# EAGLE schematic AuxTalon_LoadSwitch (EAGLE 9.6.2)

## Sheet 1 of 3

## Sheet 2 of 3
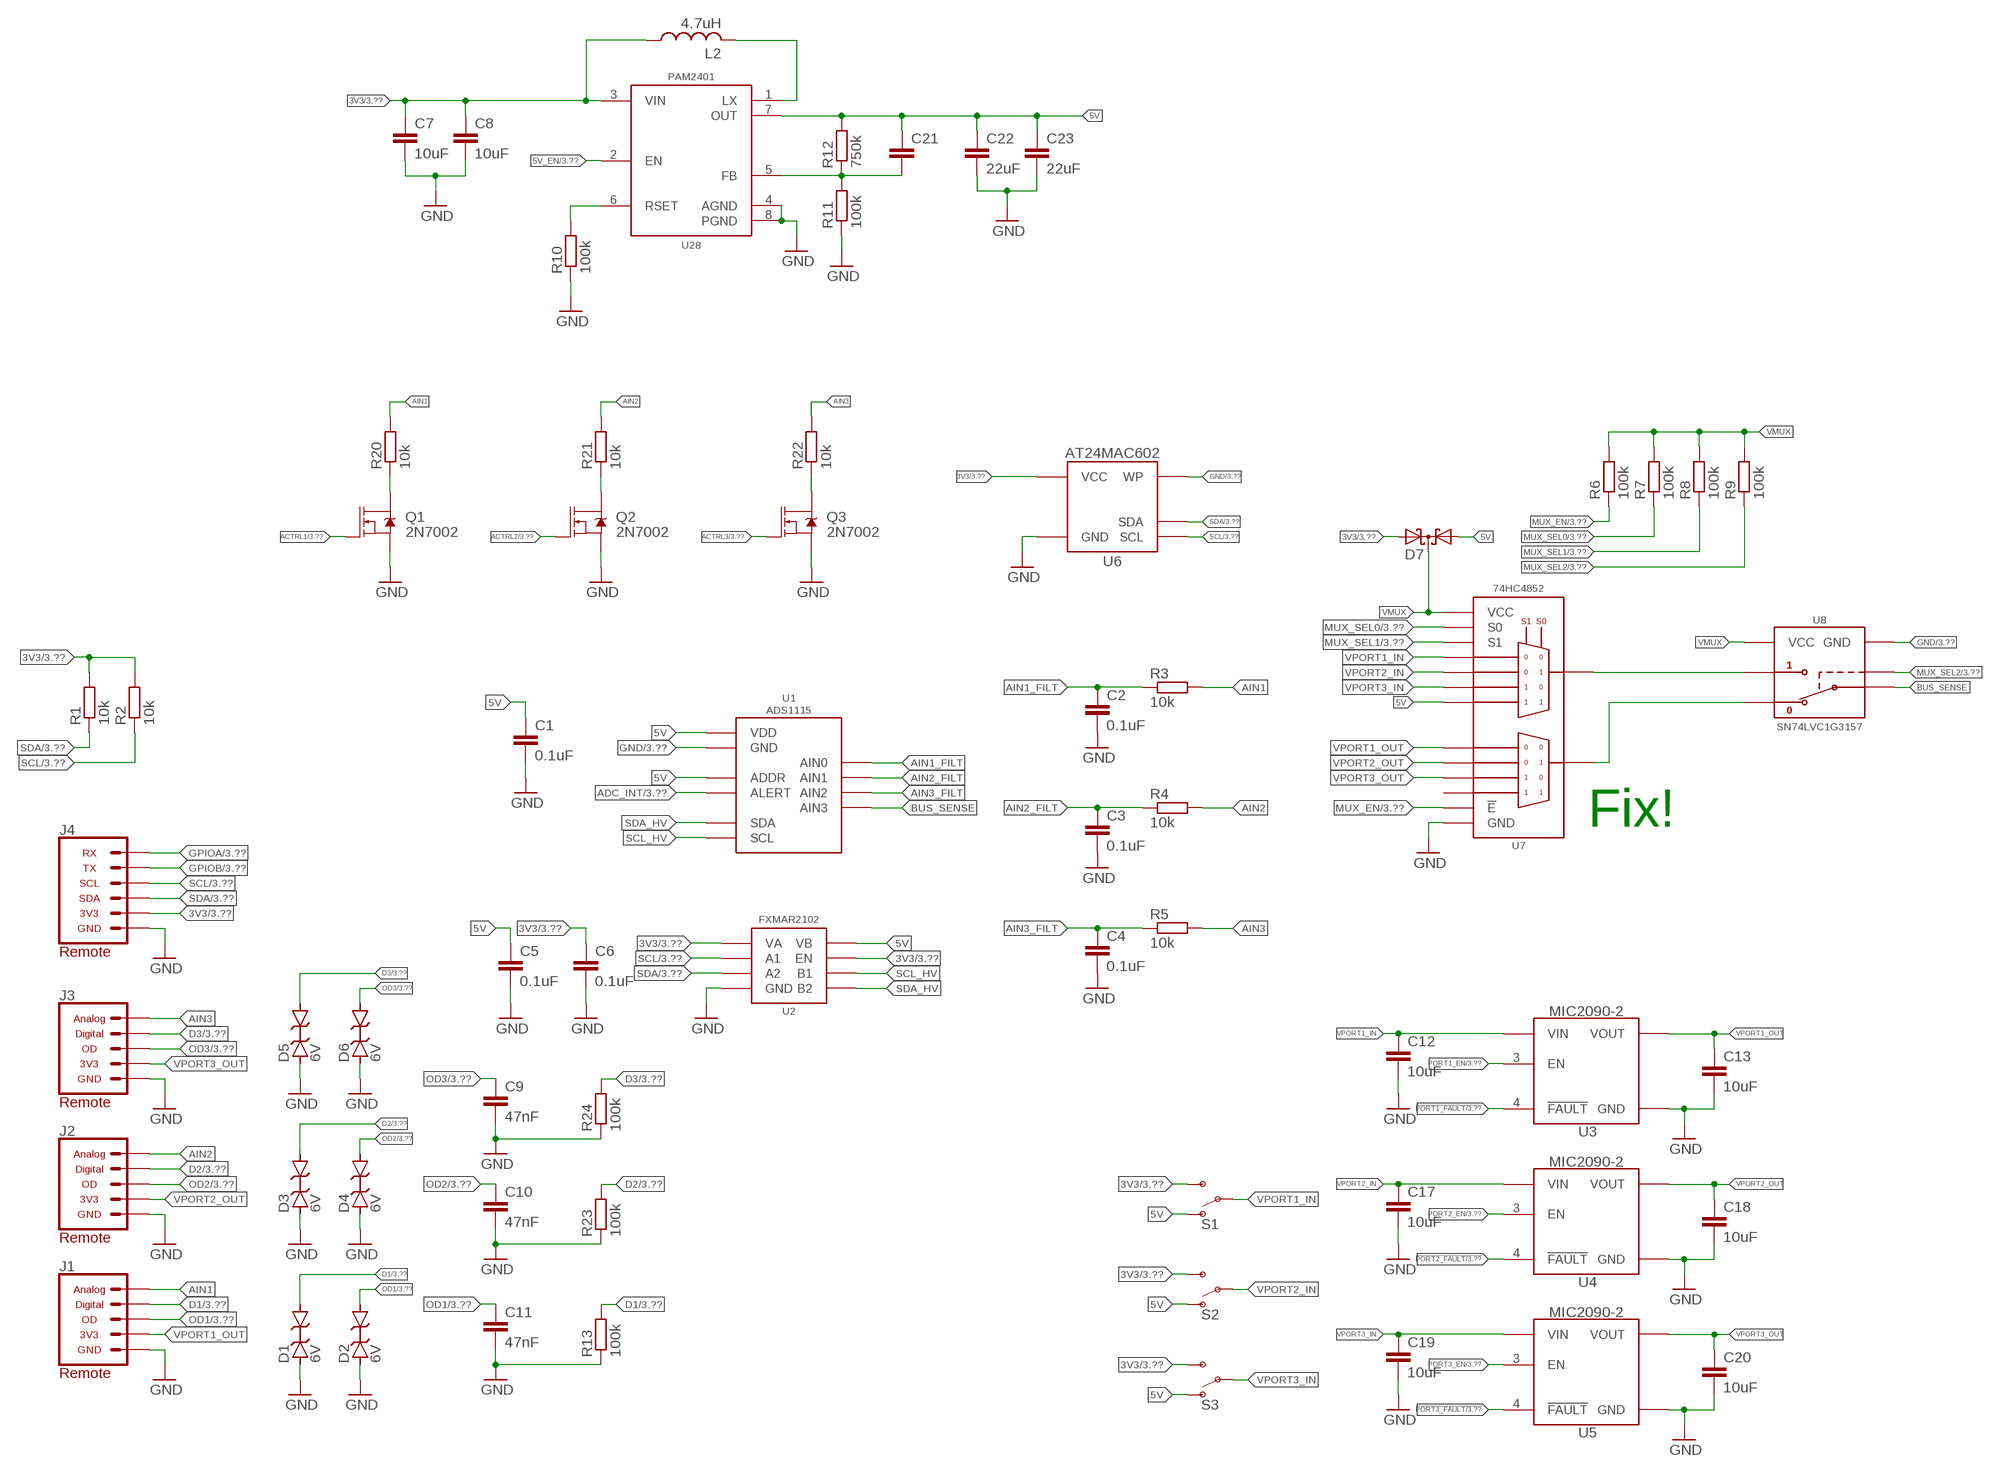
[diagram p0: schematic, sheet 2]

### Parts
C1  0.1uF  C-EU0.1UFC0402  [C0402]
C2  0.1uF  C-EU0.1UFC0805  [C0805]
C3  0.1uF  C-EU0.1UFC0805  [C0805]
C4  0.1uF  C-EU0.1UFC0805  [C0805]
C5  0.1uF  C-EU0.1UFC0402  [C0402]
C6  0.1uF  C-EU0.1UFC0402  [C0402]
C7  10uF  C-EU10UFC0805  [C0805]
C8  10uF  C-EU10UFC0805  [C0805]
C9  47nF  C-EU47NFC0402  [C0402]
C10  47nF  C-EU47NFC0402  [C0402]
C11  47nF  C-EU47NFC0402  [C0402]
C12  10uF  C-EU10UFC0805  [C0805]
C13  10uF  C-EU10UFC0603  [C0603]
C17  10uF  C-EU10UFC0805  [C0805]
C18  10uF  C-EU10UFC0603  [C0603]
C19  10uF  C-EU10UFC0805  [C0805]
C20  10uF  C-EU10UFC0603  [C0603]
C21  C-EUC0402  [C0402]
C22  22uF  C-EU22UFC0805  [C0805]
C23  22uF  C-EU22UFC0805  [C0805]
D1  6V  DIODE_ESD_BI_D5V0L1_0402  [D0402]
D2  6V  DIODE_ESD_BI_D5V0L1_0402  [D0402]
D3  6V  DIODE_ESD_BI_D5V0L1_0402  [D0402]
D4  6V  DIODE_ESD_BI_D5V0L1_0402  [D0402]
D5  6V  DIODE_ESD_BI_D5V0L1_0402  [D0402]
D6  6V  DIODE_ESD_BI_D5V0L1_0402  [D0402]
D7  DIODE_CCBAT54CSOT23  [SOT23-3]
J1  CONN_AUX_M12_REMOTE  [1X05_M12_TE_T41410]
J2  CONN_AUX_M12_REMOTE  [1X05_M12_TE_T41410]
J3  CONN_AUX_M12_REMOTE  [1X05_M12_TE_T41410]
J4  CONN_TALON_REMOTE  [1X06_MICROLOCKPLUS]
L2  4.7uH  INDUCTOR_MAPI_2.5X2  [WE-MAPI(2.5X2)]
Q1  2N7002  MOSFET-NCH-2N7002P  [SOT23-3]
Q2  2N7002  MOSFET-NCH-2N7002P  [SOT23-3]
Q3  2N7002  MOSFET-NCH-2N7002P  [SOT23-3]
R1  10k  R-EU_10KR0402  [R0402]
R2  10k  R-EU_10KR0402  [R0402]
R3  10k  R-EU_10KR0402  [R0402]
R4  10k  R-EU_10KR0402  [R0402]
R5  10k  R-EU_10KR0402  [R0402]
R6  100k  R-EU_100KR0402  [R0402]
R7  100k  R-EU_100KR0402  [R0402]
R8  100k  R-EU_100KR0402  [R0402]
R9  100k  R-EU_100KR0402  [R0402]
R10  100k  R-EU_100KR0603  [R0603]
R11  100k  R-EU_100KR0603  [R0603]
R12  750k  R-EU_750KR0603  [R0603]
R13  100k  R-EU_100KR0402  [R0402]
R20  10k  R-EU_10KR0402  [R0402]
R21  10k  R-EU_10KR0402  [R0402]
R22  10k  R-EU_10KR0402  [R0402]
R23  100k  R-EU_100KR0402  [R0402]
R24  100k  R-EU_100KR0402  [R0402]
S1  SPDTCAS-120A1  [CAS-120A1]
S2  SPDTCAS-120A1  [CAS-120A1]
S3  SPDTCAS-120A1  [CAS-120A1]
U1  ADS1115  [VSSOP_10]
U2  FXMAR2102UMLP  [UQFN-8_1.4X1.2]
U3  MIC2090-2  [SOT23-5]
U4  MIC2090-2  [SOT23-5]
U5  MIC2090-2  [SOT23-5]
U6  AT24MAC602SOT23  [SOT23-5]
U7  74HC4852  [VQFN-16]
U8  SN74LVC1G3157SC70  [DCK_R-PDSO-G6]
U28  PAM2401MSOP  [MSOP_8]

### Nets
3V3: C6.1 C7.1 C8.1 D7.2(A2) J4.2(3V3) L2.P$1 R1.2 R2.2 S1.3(S) S2.3(S) S3.3(S) U2.1(VA) U2.5(EN) U6.4(VCC) U28.3(VIN) ; also sheet 3
5V: C1.1 C5.1 C21.1 C22.1 C23.1 D7.1(A1) R12.2 S1.1(O) S2.1(O) S3.1(O) U1.1(ADDR) U1.8(VDD) U2.8(VB) U7.11(1Y3) U28.7(OUT)
5V_EN: U28.2(EN) ; also sheet 3
!PORT1_FAULT: U3.4(!FAULT) ; also sheet 3
!PORT2_FAULT: U4.4(!FAULT) ; also sheet 3
!PORT3_FAULT: U5.4(!FAULT) ; also sheet 3
ACTRL1: Q1.1(G) ; also sheet 3
ACTRL2: Q2.1(G) ; also sheet 3
ACTRL3: Q3.1(G) ; also sheet 3
ADC_INT: U1.2(ALERT) ; also sheet 3
AIN1: J1.4(ANALOG) R3.2 R20.2
AIN1_FILT: C2.1 R3.1 U1.4(AIN0)
AIN2: J2.4(ANALOG) R4.2 R21.2
AIN2_FILT: C3.1 R4.1 U1.5(AIN1)
AIN3: J3.4(ANALOG) R5.2 R22.2
AIN3_FILT: C4.1 R5.1 U1.6(AIN2)
BUS_SENSE: U1.7(AIN3) U8.4(A)
D1: D1.2(C) J1.5(DIGITAL) R13.2 ; also sheet 3
D2: D3.2(C) J2.5(DIGITAL) R23.2 ; also sheet 3
D3: D5.2(C) J3.5(DIGITAL) R24.2 ; also sheet 3
GND: C1.2 C2.2 C3.2 C4.2 C5.2 C6.2 C7.2 C8.2 C9.2 C10.2 C11.2 C12.2 C13.2 C17.2 C18.2 C19.2 C20.2 C22.2 C23.2 D1.1(A) D2.1(A) D3.1(A) D4.1(A) D5.1(A) D6.1(A) J1.3(GND) J2.3(GND) J3.3(GND) J4.1(GND) Q1.2(S) Q2.2(S) Q3.2(S) R10.1 R11.1 R13.1 R23.1 R24.1 U1.3(GND) U2.4(GND) U3.2(GND) U4.2(GND) U5.2(GND) U6.2(GND) U6.5(WP) U7.8(GND) U7.EP(GND) U8.2(GND) U28.4(AGND) U28.8(PGND) ; also sheet 3
GPIOA: J4.6(RX) ; also sheet 3
GPIOB: J4.5(TX) ; also sheet 3
MUX_EN: R6.1 U7.6(!E) ; also sheet 3
MUX_SEL0: R7.1 U7.10(S0) ; also sheet 3
MUX_SEL1: R8.1 U7.9(S1) ; also sheet 3
MUX_SEL2: R9.1 U8.6(S) ; also sheet 3
N$1: U7.3(2Z) U8.3(B1)
N$2: R10.2 U28.6(RSET)
N$3: C21.2 R11.2 R12.1 U28.5(FB)
N$7: Q3.3(D) R22.1
N$14: Q2.3(D) R21.1
N$15: Q1.3(D) R20.1
N$18: L2.P$2 U28.1(LX)
N$38: U7.13(1Z) U8.1(B2)
OD1: C11.1 D2.2(C) J1.2(DIGITAL_OPENDRAIN) ; also sheet 3
OD2: C10.1 D4.2(C) J2.2(DIGITAL_OPENDRAIN) ; also sheet 3
OD3: C9.1 D6.2(C) J3.2(DIGITAL_OPENDRAIN) ; also sheet 3
PORT1_EN: U3.3(EN) ; also sheet 3
PORT2_EN: U4.3(EN) ; also sheet 3
PORT3_EN: U5.3(EN) ; also sheet 3
SCL: J4.4(SCL) R2.1 U2.2(A1) U6.1(SCL) ; also sheet 3
SCL_HV: U1.10(SCL) U2.7(B1)
SDA: J4.3(SDA) R1.1 U2.3(A2) U6.3(SDA) ; also sheet 3
SDA_HV: U1.9(SDA) U2.6(B2)
VMUX: D7.3(C) R6.2 R7.2 R8.2 R9.2 U7.16(VCC) U8.5(VCC)
VPORT1_IN: C12.1 S1.2(P) U3.1(VIN) U7.12(1Y0)
VPORT1_OUT: C13.1 J1.1(3V3) U3.5(VOUT) U7.1(2Y0)
VPORT2_IN: C17.1 S2.2(P) U4.1(VIN) U7.14(1Y1)
VPORT2_OUT: C18.1 J2.1(3V3) U4.5(VOUT) U7.5(2Y1)
VPORT3_IN: C19.1 S3.2(P) U5.1(VIN) U7.15(1Y2)
VPORT3_OUT: C20.1 J3.1(3V3) U5.5(VOUT) U7.2(2Y2)
Unconnected: U7.4(2Y3)

### Notes on the sheet
- Fix!

## Sheet 3 of 3
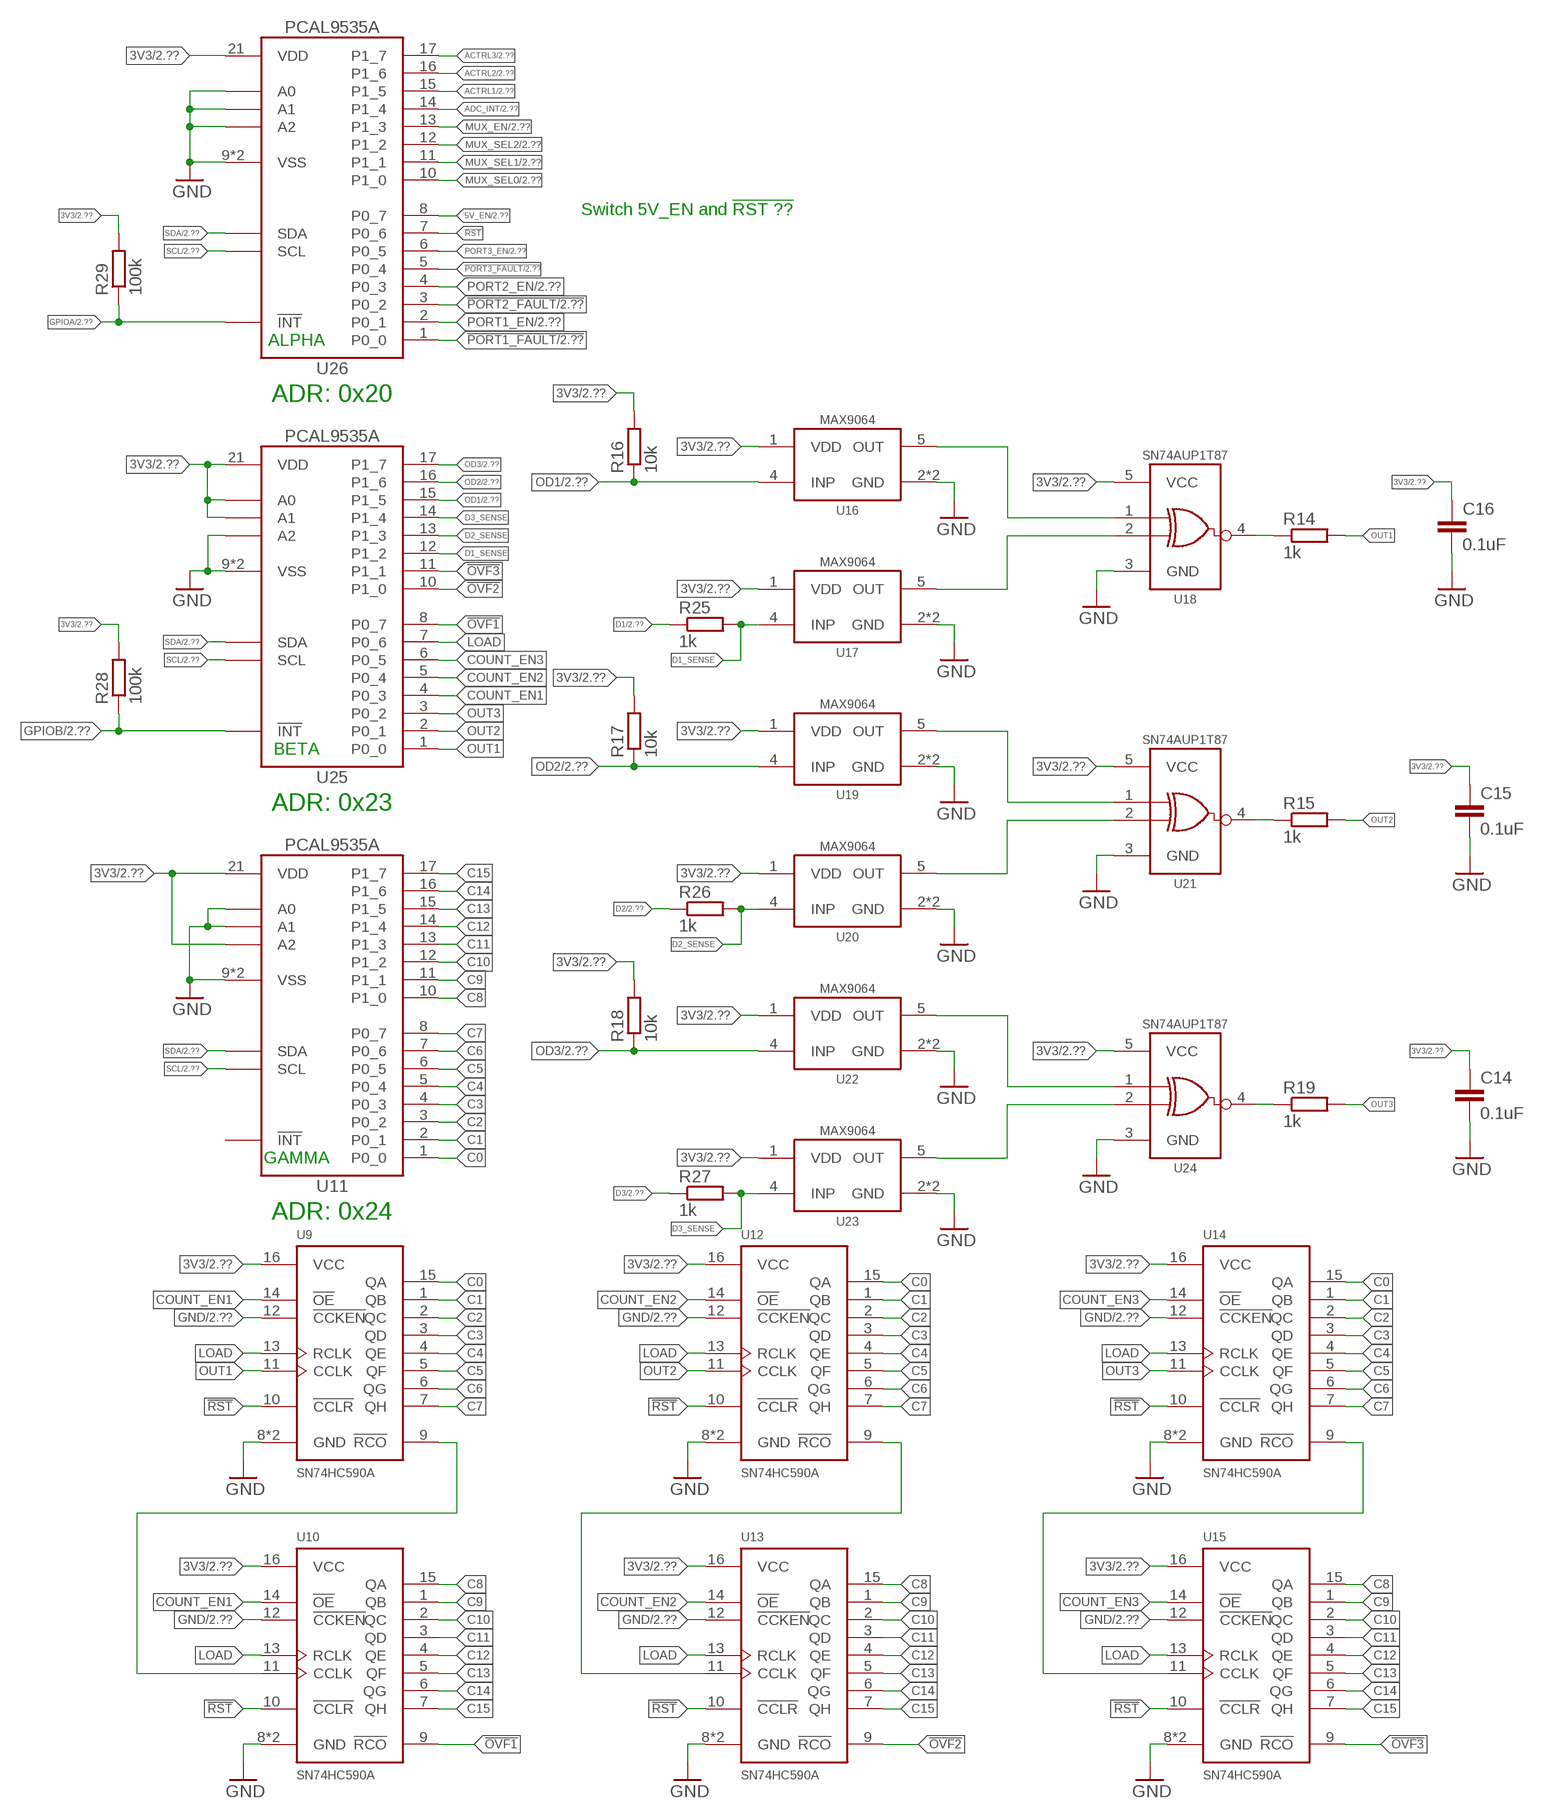
[diagram p1: schematic, sheet 3]

### Parts
C14  0.1uF  C-EU0.1UFC0402  [C0402]
C15  0.1uF  C-EU0.1UFC0402  [C0402]
C16  0.1uF  C-EU0.1UFC0402  [C0402]
R14  1k  R-EU_1KR0402  [R0402]
R15  1k  R-EU_1KR0402  [R0402]
R16  10k  R-EU_10KR0402  [R0402]
R17  10k  R-EU_10KR0402  [R0402]
R18  10k  R-EU_10KR0402  [R0402]
R19  1k  R-EU_1KR0402  [R0402]
R25  1k  R-EU_1KR0402  [R0402]
R26  1k  R-EU_1KR0402  [R0402]
R27  1k  R-EU_1KR0402  [R0402]
R28  100k  R-EU_100KR0402  [R0402]
R29  100k  R-EU_100KR0402  [R0402]
U9  SN74HC590AVQFN  [VQFN-16]
U10  SN74HC590AVQFN  [VQFN-16]
U11  PCAL9535AQFN  [QFN24]
U12  SN74HC590AVQFN  [VQFN-16]
U13  SN74HC590AVQFN  [VQFN-16]
U14  SN74HC590AVQFN  [VQFN-16]
U15  SN74HC590AVQFN  [VQFN-16]
U16  MAX9064  [SOT23-5]
U17  MAX9064  [SOT23-5]
U18  SN74AUP1T87  [DCK_R-PDSO-G5]
U19  MAX9064  [SOT23-5]
U20  MAX9064  [SOT23-5]
U21  SN74AUP1T87  [DCK_R-PDSO-G5]
U22  MAX9064  [SOT23-5]
U23  MAX9064  [SOT23-5]
U24  SN74AUP1T87  [DCK_R-PDSO-G5]
U25  PCAL9535AQFN  [QFN24]
U26  PCAL9535AQFN  [QFN24]

### Nets
3V3: C14.1 C15.1 C16.1 R16.2 R17.2 R18.2 R28.2 R29.2 U9.16(VCC) U10.16(VCC) U11.21(VDD) U11.24(A2) U12.16(VCC) U13.16(VCC) U14.16(VCC) U15.16(VCC) U16.1(VDD) U17.1(VDD) U18.5(VCC) U19.1(VDD) U20.1(VDD) U21.5(VCC) U22.1(VDD) U23.1(VDD) U24.5(VCC) U25.18(A0) U25.21(VDD) U25.23(A1) U26.21(VDD) ; also sheet 2
5V_EN: U26.8(P0_7) ; also sheet 2
!OVF1: U10.9(!RCO) U25.8(P0_7)
!OVF2: U13.9(!RCO) U25.10(P1_0)
!OVF3: U15.9(!RCO) U25.11(P1_1)
!PORT1_FAULT: U26.1(P0_0) ; also sheet 2
!PORT2_FAULT: U26.3(P0_2) ; also sheet 2
!PORT3_FAULT: U26.5(P0_4) ; also sheet 2
!RST: U9.10(!CCLR) U10.10(!CCLR) U12.10(!CCLR) U13.10(!CCLR) U14.10(!CCLR) U15.10(!CCLR) U26.7(P0_6)
ACTRL1: U26.15(P1_5) ; also sheet 2
ACTRL2: U26.16(P1_6) ; also sheet 2
ACTRL3: U26.17(P1_7) ; also sheet 2
ADC_INT: U26.14(P1_4) ; also sheet 2
C0: U9.15(QA) U11.1(P0_0) U12.15(QA) U14.15(QA)
C1: U9.1(QB) U11.2(P0_1) U12.1(QB) U14.1(QB)
C2: U9.2(QC) U11.3(P0_2) U12.2(QC) U14.2(QC)
C3: U9.3(QD) U11.4(P0_3) U12.3(QD) U14.3(QD)
C4: U9.4(QE) U11.5(P0_4) U12.4(QE) U14.4(QE)
C5: U9.5(QF) U11.6(P0_5) U12.5(QF) U14.5(QF)
C6: U9.6(QG) U11.7(P0_6) U12.6(QG) U14.6(QG)
C7: U9.7(QH) U11.8(P0_7) U12.7(QH) U14.7(QH)
C8: U10.15(QA) U11.10(P1_0) U13.15(QA) U15.15(QA)
C9: U10.1(QB) U11.11(P1_1) U13.1(QB) U15.1(QB)
C10: U10.2(QC) U11.12(P1_2) U13.2(QC) U15.2(QC)
C11: U10.3(QD) U11.13(P1_3) U13.3(QD) U15.3(QD)
C12: U10.4(QE) U11.14(P1_4) U13.4(QE) U15.4(QE)
C13: U10.5(QF) U11.15(P1_5) U13.5(QF) U15.5(QF)
C14: U10.6(QG) U11.16(P1_6) U13.6(QG) U15.6(QG)
C15: U10.7(QH) U11.17(P1_7) U13.7(QH) U15.7(QH)
COUNT_EN1: U9.14(!OE) U10.14(!OE) U25.4(P0_3)
COUNT_EN2: U12.14(!OE) U13.14(!OE) U25.5(P0_4)
COUNT_EN3: U14.14(!OE) U15.14(!OE) U25.6(P0_5)
D1: R25.1 ; also sheet 2
D1_SENSE: R25.2 U17.4(INP) U25.12(P1_2)
D2: R26.1 ; also sheet 2
D2_SENSE: R26.2 U20.4(INP) U25.13(P1_3)
D3: R27.1 ; also sheet 2
D3_SENSE: R27.2 U23.4(INP) U25.14(P1_4)
GND: C14.2 C15.2 C16.2 U9.8(GND) U9.12(!CCKEN) U9.EP(GND) U10.8(GND) U10.12(!CCKEN) U10.EP(GND) U11.9(VSS) U11.18(A0) U11.23(A1) U11.EP(VSS) U12.8(GND) U12.12(!CCKEN) U12.EP(GND) U13.8(GND) U13.12(!CCKEN) U13.EP(GND) U14.8(GND) U14.12(!CCKEN) U14.EP(GND) U15.8(GND) U15.12(!CCKEN) U15.EP(GND) U16.2(GND) U16.3(GND) U17.2(GND) U17.3(GND) U18.3(GND) U19.2(GND) U19.3(GND) U20.2(GND) U20.3(GND) U21.3(GND) U22.2(GND) U22.3(GND) U23.2(GND) U23.3(GND) U24.3(GND) U25.9(VSS) U25.24(A2) U25.EP(VSS) U26.9(VSS) U26.18(A0) U26.23(A1) U26.24(A2) U26.EP(VSS) ; also sheet 2
GPIOA: R29.1 U26.22(!INT) ; also sheet 2
GPIOB: R28.1 U25.22(!INT) ; also sheet 2
LOAD: U9.13(RCLK) U10.13(RCLK) U12.13(RCLK) U13.13(RCLK) U14.13(RCLK) U15.13(RCLK) U25.7(P0_6)
MUX_EN: U26.13(P1_3) ; also sheet 2
MUX_SEL0: U26.10(P1_0) ; also sheet 2
MUX_SEL1: U26.11(P1_1) ; also sheet 2
MUX_SEL2: U26.12(P1_2) ; also sheet 2
N$4: U9.9(!RCO) U10.11(CCLK)
N$5: U12.9(!RCO) U13.11(CCLK)
N$6: U14.9(!RCO) U15.11(CCLK)
N$8: U20.5(OUT) U21.2(B)
N$9: U19.5(OUT) U21.1(A)
N$10: U16.5(OUT) U18.1(A)
N$11: U17.5(OUT) U18.2(B)
N$12: U23.5(OUT) U24.2(B)
N$13: U22.5(OUT) U24.1(A)
N$16: R14.1 U18.4(Y)
N$17: R15.1 U21.4(Y)
N$19: R19.1 U24.4(Y)
OD1: R16.1 U16.4(INP) U25.15(P1_5) ; also sheet 2
OD2: R17.1 U19.4(INP) U25.16(P1_6) ; also sheet 2
OD3: R18.1 U22.4(INP) U25.17(P1_7) ; also sheet 2
OUT1: R14.2 U9.11(CCLK) U25.1(P0_0)
OUT2: R15.2 U12.11(CCLK) U25.2(P0_1)
OUT3: R19.2 U14.11(CCLK) U25.3(P0_2)
PORT1_EN: U26.2(P0_1) ; also sheet 2
PORT2_EN: U26.4(P0_3) ; also sheet 2
PORT3_EN: U26.6(P0_5) ; also sheet 2
SCL: U11.19(SCL) U25.19(SCL) U26.19(SCL) ; also sheet 2
SDA: U11.20(SDA) U25.20(SDA) U26.20(SDA) ; also sheet 2
Unconnected: U11.22(!INT)

### Notes on the sheet
- Switch 5V_EN and !RST ??
- ALPHA
- ADR: 0x20
- BETA
- ADR: 0x23
- GAMMA
- ADR: 0x24

## Library data of the parts
C1 C5 C6 C14-C16 = bschulz_passives:C-EU: CAPACITOR, European symbol; DIGIKEY: 490-4759-1-ND; MF: Murata; MPN: GCM155R71C104KA55D
C2-C4 = bschulz_passives:C-EU: CAPACITOR, European symbol; DIGIKEY: 399-8000-1-ND; MF: Kemet; MPN: C0805C104M3RACTU
C7 C8 C12 C17 C19 = bschulz_passives:C-EU: CAPACITOR, European symbol; DIGIKEY: 490-6473-1-ND; MF: Murata; MPN: GRM21BR61C106KE15K
C9-C11 = bschulz_passives:C-EU: CAPACITOR, European symbol; DIGIKEY: 490-3254-1-ND; MF: Murata; MPN: GRM155R71E473KA88D
C13 C18 C20 = bschulz_passives:C-EU: CAPACITOR, European symbol; DIGIKEY: 490-10728-1-ND; MF: Murata; MPN: GRM188R61C106KAALD
C21 = bschulz_passives:C-EU: CAPACITOR, European symbol; DIGIKEY: DNP; MF: N/A; MPN: DNP
C22 C23 = bschulz_passives:C-EU: CAPACITOR, European symbol; DIGIKEY: 490-9952-1-ND; MF: Murata; MPN: GRM219R61C226ME15L
D1-D6 = bschulz:DIODE_ESD_BI: Generic Bidirectional ESD Diode; DIGIKEY: D5V0L1B2LP4-7BDICT-ND; MF: Diodes Inc; MPN: D5V0L1B2LP4-7B
D7 = bschulz:DIODE_CC: Dual Diode, Common Cathode BAT54C Vr, max: 30V Iavg: 200mA Vf: 800mv @ 100mA Reverse Leakage: 2μA @ 25V SDM40E20LC Vr, max: 20V Iavg: 400mA Vf: 310mv @ 100mA Reverse Leakage: 250μA @ 20V; DIGIKEY: BAT54CLT1GOSCT-ND; MF: ON Semiconductor; MPN: BAT54CLT1G
J1-J3 = GEMS_Plugs:CONN_AUX: GEMS Connector for Auiliary Port Devices; DIGIKEY: A126851-ND; DISP: Remote; MF: TE; MPN: T4141012051-000
J4 = GEMS_Plugs:CONN_TALON: GEMS Connector for Talon Interface; DIGIKEY: 900-2059570671CT-ND; DISP: Remote; MF: Molex; MPN: 2059570671
L2 = bschulz:INDUCTOR: Genaric Inductor; DIGIKEY: 732-4848-1-ND; MF: Wurth; MPN: 74438323047
Q1-Q3 = bschulz:MOSFET-NCH: N-channel MOSFET Small Signal/Low Power: BSS138 2N7002P 2N7002PW RE1C002UN; DIGIKEY: 1727-4692-1-ND; MF: Nexperia; MPN: 2N7002P,215
R1-R5 R16-R18 R20-R22 = bschulz_passives:R-EU_: RESISTOR, European symbol Digikey Parts: Yageo, 0402 <https://www.digikey.com/products/en/resistors/chip-resistor-surface-mount/52?k=&pkeyword=&sv=0&s=4356&sf=1&FV=-1%7C13%2C7%7C2%2C1291%7C39157%2C1989%7C0%2C-8%7C52%2C3%7C1131%2C3%7C2503&quantity=&ColumnSort=0&page=1&stock=1&pageSize=25> Yageo, 0603 <https://www.digikey.com/products/en/resistors/chip-resistor-surface-mount/52?k=&pkeyword=&sv=0&pv1291=39245&sf=1&FV=-5%7C4356%2C-5%7C47360%2C-8%7C52%2C-1%7C13%2C7%7C2%2C1989%7C0&quantity=10&ColumnSort=1000011&page=1&stock=1&pageSize=25> Panasonic, 0603 <https://www.digikey.com/products/en/resistors/chip-resistor-surface-mount/52?k=&pkeyword=&pv252=68&sf=0&FV=ffec373d%2C1c0002%2C142c040c%2C1f140000%2Cffe00034%2C80002%2Cc0001&quantity=&ColumnSort=0&page=1&stock=1&pageSize=25> Panasonic, precision, 0603 <https://www.digikey.com/products/en/resistors/chip-resistor-surface-mount/52?FV=ffec4907%2Cfffc000a%2Cc0172%2C142c040c%2C1f140000%2Cffe00034%2C1c0002&quantity=100&ColumnSort=2085&page=1&stock=1&pageSize=25> Panasonic, 0805 <https://www.digikey.com/products/en/resistors/chip-resistor-surface-mount/52?k=&pkeyword=&pv3=1&sf=0&FV=ffec373d%2C1c0002%2C1f140000%2Cffe00034%2C142c040d&quantity=&ColumnSort=0&page=1&stock=1&pageSize=25> Rohm, current sense <https://www.digikey.com/products/en/resistors/chip-resistor-surface-mount/52?k=&pkeyword=&pv3=1&sf=0&FV=ffecb688%2C1f140000%2Cffe00034%2C1c0002&quantity=&ColumnSort=0&page=1&stock=1&pageSize=25> Vishay, pulse proof automotive <https://www.digikey.com/products/en/resistors/chip-resistor-surface-mount/52?k=&pkeyword=&pv7=2&sf=0&FV=ffec5d6b%2Cffe00034%2C1f140000&quantity=&ColumnSort=0&page=1&stock=1&pageSize=25>; DIGIKEY: 311-10.0KLRCT-ND; MF: Yageo; MPN: RC0402FR-0710KL; VALUE_PART: 10k
R6-R9 R13 R23 R24 R28 R29 = bschulz_passives:R-EU_: RESISTOR, European symbol Digikey Parts: Yageo, 0402 <https://www.digikey.com/products/en/resistors/chip-resistor-surface-mount/52?k=&pkeyword=&sv=0&s=4356&sf=1&FV=-1%7C13%2C7%7C2%2C1291%7C39157%2C1989%7C0%2C-8%7C52%2C3%7C1131%2C3%7C2503&quantity=&ColumnSort=0&page=1&stock=1&pageSize=25> Yageo, 0603 <https://www.digikey.com/products/en/resistors/chip-resistor-surface-mount/52?k=&pkeyword=&sv=0&pv1291=39245&sf=1&FV=-5%7C4356%2C-5%7C47360%2C-8%7C52%2C-1%7C13%2C7%7C2%2C1989%7C0&quantity=10&ColumnSort=1000011&page=1&stock=1&pageSize=25> Panasonic, 0603 <https://www.digikey.com/products/en/resistors/chip-resistor-surface-mount/52?k=&pkeyword=&pv252=68&sf=0&FV=ffec373d%2C1c0002%2C142c040c%2C1f140000%2Cffe00034%2C80002%2Cc0001&quantity=&ColumnSort=0&page=1&stock=1&pageSize=25> Panasonic, precision, 0603 <https://www.digikey.com/products/en/resistors/chip-resistor-surface-mount/52?FV=ffec4907%2Cfffc000a%2Cc0172%2C142c040c%2C1f140000%2Cffe00034%2C1c0002&quantity=100&ColumnSort=2085&page=1&stock=1&pageSize=25> Panasonic, 0805 <https://www.digikey.com/products/en/resistors/chip-resistor-surface-mount/52?k=&pkeyword=&pv3=1&sf=0&FV=ffec373d%2C1c0002%2C1f140000%2Cffe00034%2C142c040d&quantity=&ColumnSort=0&page=1&stock=1&pageSize=25> Rohm, current sense <https://www.digikey.com/products/en/resistors/chip-resistor-surface-mount/52?k=&pkeyword=&pv3=1&sf=0&FV=ffecb688%2C1f140000%2Cffe00034%2C1c0002&quantity=&ColumnSort=0&page=1&stock=1&pageSize=25> Vishay, pulse proof automotive <https://www.digikey.com/products/en/resistors/chip-resistor-surface-mount/52?k=&pkeyword=&pv7=2&sf=0&FV=ffec5d6b%2Cffe00034%2C1f140000&quantity=&ColumnSort=0&page=1&stock=1&pageSize=25>; DIGIKEY: 311-100KLRCT-ND; MF: Yageo; MPN: RC0402FR-07100KL; VALUE_PART: 100k
R10 R11 = bschulz_passives:R-EU_: RESISTOR, European symbol Digikey Parts: Yageo, 0402 <https://www.digikey.com/products/en/resistors/chip-resistor-surface-mount/52?k=&pkeyword=&sv=0&s=4356&sf=1&FV=-1%7C13%2C7%7C2%2C1291%7C39157%2C1989%7C0%2C-8%7C52%2C3%7C1131%2C3%7C2503&quantity=&ColumnSort=0&page=1&stock=1&pageSize=25> Yageo, 0603 <https://www.digikey.com/products/en/resistors/chip-resistor-surface-mount/52?k=&pkeyword=&sv=0&pv1291=39245&sf=1&FV=-5%7C4356%2C-5%7C47360%2C-8%7C52%2C-1%7C13%2C7%7C2%2C1989%7C0&quantity=10&ColumnSort=1000011&page=1&stock=1&pageSize=25> Panasonic, 0603 <https://www.digikey.com/products/en/resistors/chip-resistor-surface-mount/52?k=&pkeyword=&pv252=68&sf=0&FV=ffec373d%2C1c0002%2C142c040c%2C1f140000%2Cffe00034%2C80002%2Cc0001&quantity=&ColumnSort=0&page=1&stock=1&pageSize=25> Panasonic, precision, 0603 <https://www.digikey.com/products/en/resistors/chip-resistor-surface-mount/52?FV=ffec4907%2Cfffc000a%2Cc0172%2C142c040c%2C1f140000%2Cffe00034%2C1c0002&quantity=100&ColumnSort=2085&page=1&stock=1&pageSize=25> Panasonic, 0805 <https://www.digikey.com/products/en/resistors/chip-resistor-surface-mount/52?k=&pkeyword=&pv3=1&sf=0&FV=ffec373d%2C1c0002%2C1f140000%2Cffe00034%2C142c040d&quantity=&ColumnSort=0&page=1&stock=1&pageSize=25> Rohm, current sense <https://www.digikey.com/products/en/resistors/chip-resistor-surface-mount/52?k=&pkeyword=&pv3=1&sf=0&FV=ffecb688%2C1f140000%2Cffe00034%2C1c0002&quantity=&ColumnSort=0&page=1&stock=1&pageSize=25> Vishay, pulse proof automotive <https://www.digikey.com/products/en/resistors/chip-resistor-surface-mount/52?k=&pkeyword=&pv7=2&sf=0&FV=ffec5d6b%2Cffe00034%2C1f140000&quantity=&ColumnSort=0&page=1&stock=1&pageSize=25>; DIGIKEY: 311-100KHRCT-ND; MF: Yageo; MPN: RC0603FR-07100KL; VALUE_PART: 100k
R12 = bschulz_passives:R-EU_: RESISTOR, European symbol Digikey Parts: Yageo, 0402 <https://www.digikey.com/products/en/resistors/chip-resistor-surface-mount/52?k=&pkeyword=&sv=0&s=4356&sf=1&FV=-1%7C13%2C7%7C2%2C1291%7C39157%2C1989%7C0%2C-8%7C52%2C3%7C1131%2C3%7C2503&quantity=&ColumnSort=0&page=1&stock=1&pageSize=25> Yageo, 0603 <https://www.digikey.com/products/en/resistors/chip-resistor-surface-mount/52?k=&pkeyword=&sv=0&pv1291=39245&sf=1&FV=-5%7C4356%2C-5%7C47360%2C-8%7C52%2C-1%7C13%2C7%7C2%2C1989%7C0&quantity=10&ColumnSort=1000011&page=1&stock=1&pageSize=25> Panasonic, 0603 <https://www.digikey.com/products/en/resistors/chip-resistor-surface-mount/52?k=&pkeyword=&pv252=68&sf=0&FV=ffec373d%2C1c0002%2C142c040c%2C1f140000%2Cffe00034%2C80002%2Cc0001&quantity=&ColumnSort=0&page=1&stock=1&pageSize=25> Panasonic, precision, 0603 <https://www.digikey.com/products/en/resistors/chip-resistor-surface-mount/52?FV=ffec4907%2Cfffc000a%2Cc0172%2C142c040c%2C1f140000%2Cffe00034%2C1c0002&quantity=100&ColumnSort=2085&page=1&stock=1&pageSize=25> Panasonic, 0805 <https://www.digikey.com/products/en/resistors/chip-resistor-surface-mount/52?k=&pkeyword=&pv3=1&sf=0&FV=ffec373d%2C1c0002%2C1f140000%2Cffe00034%2C142c040d&quantity=&ColumnSort=0&page=1&stock=1&pageSize=25> Rohm, current sense <https://www.digikey.com/products/en/resistors/chip-resistor-surface-mount/52?k=&pkeyword=&pv3=1&sf=0&FV=ffecb688%2C1f140000%2Cffe00034%2C1c0002&quantity=&ColumnSort=0&page=1&stock=1&pageSize=25> Vishay, pulse proof automotive <https://www.digikey.com/products/en/resistors/chip-resistor-surface-mount/52?k=&pkeyword=&pv7=2&sf=0&FV=ffec5d6b%2Cffe00034%2C1f140000&quantity=&ColumnSort=0&page=1&stock=1&pageSize=25>; DIGIKEY: 311-750KHRCT-ND; MF: Yageo; MPN: RC0603FR-07750KL; VALUE_PART: 750k
R14 R15 R19 R25-R27 = bschulz_passives:R-EU_: RESISTOR, European symbol Digikey Parts: Yageo, 0402 <https://www.digikey.com/products/en/resistors/chip-resistor-surface-mount/52?k=&pkeyword=&sv=0&s=4356&sf=1&FV=-1%7C13%2C7%7C2%2C1291%7C39157%2C1989%7C0%2C-8%7C52%2C3%7C1131%2C3%7C2503&quantity=&ColumnSort=0&page=1&stock=1&pageSize=25> Yageo, 0603 <https://www.digikey.com/products/en/resistors/chip-resistor-surface-mount/52?k=&pkeyword=&sv=0&pv1291=39245&sf=1&FV=-5%7C4356%2C-5%7C47360%2C-8%7C52%2C-1%7C13%2C7%7C2%2C1989%7C0&quantity=10&ColumnSort=1000011&page=1&stock=1&pageSize=25> Panasonic, 0603 <https://www.digikey.com/products/en/resistors/chip-resistor-surface-mount/52?k=&pkeyword=&pv252=68&sf=0&FV=ffec373d%2C1c0002%2C142c040c%2C1f140000%2Cffe00034%2C80002%2Cc0001&quantity=&ColumnSort=0&page=1&stock=1&pageSize=25> Panasonic, precision, 0603 <https://www.digikey.com/products/en/resistors/chip-resistor-surface-mount/52?FV=ffec4907%2Cfffc000a%2Cc0172%2C142c040c%2C1f140000%2Cffe00034%2C1c0002&quantity=100&ColumnSort=2085&page=1&stock=1&pageSize=25> Panasonic, 0805 <https://www.digikey.com/products/en/resistors/chip-resistor-surface-mount/52?k=&pkeyword=&pv3=1&sf=0&FV=ffec373d%2C1c0002%2C1f140000%2Cffe00034%2C142c040d&quantity=&ColumnSort=0&page=1&stock=1&pageSize=25> Rohm, current sense <https://www.digikey.com/products/en/resistors/chip-resistor-surface-mount/52?k=&pkeyword=&pv3=1&sf=0&FV=ffecb688%2C1f140000%2Cffe00034%2C1c0002&quantity=&ColumnSort=0&page=1&stock=1&pageSize=25> Vishay, pulse proof automotive <https://www.digikey.com/products/en/resistors/chip-resistor-surface-mount/52?k=&pkeyword=&pv7=2&sf=0&FV=ffec5d6b%2Cffe00034%2C1f140000&quantity=&ColumnSort=0&page=1&stock=1&pageSize=25>; DIGIKEY: 311-1.00KLRCT-ND; MF: Yageo; MPN: RC0402FR-071KL; VALUE_PART: 1k
S1-S3 = bschulz:SPDT: Genaric SPDT switch; DIGIKEY: CAS120JCT-ND; MF: Nidec Copal; MPN: CAS-120TA
U1 = bschulz:ADS111*: ADS1115 - Sigma Delta ADC Characteristics: VCC: 2~5.5V Resolution: 16 bits (12 bits for ADS1015) Number of Inputs: 4 (2 Differenital) Sample Rate: 860 Samples Per Second (3300 for ADS1015) Operating Temperature: -40°C to 125°C Digikey: 296-38849-1-ND (ADS1115) <https://www.digikey.com/scripts/DkSearch/dksus.dll?Detail&itemSeq=258904888&uq=636603311183646020> 296-41185-1-ND (ADS1015) <https://www.digikey.com/product-detail/en/texas-instruments/ADS1015IDGSR/296-41185-1-ND/5222640>; DIGIKEY: 296-38849-1-ND; MF: TI; MPN: ADS1115IDGSR
U2 = bschulz:FXMAR2102: FXMAR2102 - 2 Channel Bidirectional Voltage Level Translator for I2C Applications Characteristics: Vcc: 1.65 ~ 5.5V IQ: <5μA Output Current: 50mA Output Type: Open Drain/Push-Pull Operating Temperature: -40°C to 85°C Digikey: FXMAR2102UMX-F106CT-ND (UMLP) <https://www.digikey.com/en/products/detail/onsemi/FXMAR2102UMX-F106/5050715>; DIGIKEY: FXMAR2102UMX-F106CT-ND; DISP: FXMAR2102; MF: OnSemi; MPN: FXMAR2102UMX-F106
U3-U5 = bschulz:MIC209*: MIC209x - Hight Side Load Switch, with Fixed Current Limit Characteristics: Vin: 1.8v ~ 5.5v IQ: 5μA (OFF), 70μA (ON) RDS(ON): 700mΩ (Vin = 5v), 790mΩ (Vin = 3.3v) UVLO: 1.75V Output Current: 50/100mA (MIC2090/MIC2091) Operating Temperature: -40°C to 125°C Digikey: MIC2091-1 <https://www.digikey.com/product-detail/en/microchip-technology/MIC2091-1YM5-TR/576-3891-1-ND/2650466> MIC2090-1 <https://www.digikey.com/product-detail/en/microchip-technology/MIC2090-1YM5-TR/576-3890-1-ND/2650465> MIC2090-2 <https://www.digikey.com/en/products/detail/microchip-technology/MIC2090-2YM5-TR/2764084?s=N4IgTCBcDaILYEsDGYAMBOVBaCBdAvkA>; DIGIKEY: 576-3964-1-ND; DISP: MIC2090-2; MF: Microchip; MPN: MIC2090-2YM5-TR
U6 = bschulz:AT24MAC*02: AT24MACx02 - 2kb I2C Serial EEPROM with EUI serial number Characteristics: Vcc: 1.7V ~ 5.5V Memory: 2kb (256 x 8 bit) IQ: 1μA Temperature: -40°C to 85°C Digikey: AT24MAC602-STUM-T (SOT-23, EUI-64) <https://www.digikey.com/en/products/detail/microchip-technology/AT24MAC602-STUM-T/3973073?s=N4IgTCBcDaIIIBUwBYCycDCA2ADGAtAMoICqq%2BCIAugL5A>; DIGIKEY: AT24MAC602-STUM-TCT-ND; DISP: AT24MAC602; MF: Microchip; MPN: AT24MAC602-STUM-T
U7 = bschulz:74HC4852: 74HC4852 - Analog Multiplexer, Dual 4-Channel (1:4 x 2) Characteristics: VCC: 2 ~ 6V RON: 195Ω RCh-Ch: 3Ω, max Operating Temperature: -40°C to 85°C Digikey: 1727-7953-1-ND <https://www.digikey.com/en/products/detail/nexperia-usa-inc/74HC4852BQ-Q100-11/3678903>; DIGIKEY: 1727-7953-1-ND; DISP: 74HC4852; MF: Nexperia; MPN: 74HC4852BQ-Q100,11
U8 = bschulz:SN74LVC1G3157: SN74LVC1G3157 - SPDT Analog Switch Characteristics: VCC: 1.65~5.5V Operating Temperature: -40°C to 85°C On state resistace: 15 Ω, Max Channel to Channel Matching: 0.1 Ω, Typical Digikey: 296-14909-1-ND (SC70, DCK) <https://www.digikey.com/product-detail/en/texas-instruments/SN74LVC1G3157DCKR/296-14909-1-ND/562526> 296-18015-1-ND (SOT-666, DRL) <https://www.digikey.com/product-detail/en/texas-instruments/SN74LVC1G3157DRLR/296-18015-1-ND/770530>; DIGIKEY: 296-14909-1-ND; DISP: SN74LVC1G3157; MF: TI; MPN: SN74LVC1G3157DCKR
U9 U10 U12-U15 = bschulz:SN74HC590A: SN74HC590A - 8 bit binary counter with direct clear Characteristics: VCC: 2~6V Operating Temperature: -40°C to 85°C fmax = 2.5 MHz (for Vcc = 2v, high for higher Vcc) Digikey: 296-8340-5-ND (SOIC) <https://www.digikey.com/product-detail/en/texas-instruments/SN74HC590AD/296-8340-5-ND/376756> 296-1599-5-ND (DIP) <https://www.digikey.com/product-detail/en/texas-instruments/SN74HC590AN/296-1599-5-ND/277245> 1727-6923-1-ND (VQFN) <https://www.digikey.com/en/products/detail/74HC590BQ%2c115/1727-6923-1-ND/2814162?itemSeq=377216928>; DIGIKEY: 1727-6923-1-ND; MF: Nexperia; MPN: 74HC590BQ,115
U11 U25 U26 = bschulz:PCAL95*5A: PCAL95*5A - I2C I/O Expander, 16 bit wtih interrupt and agile IO Characteristics: Vcc: 1.65V ~ 5.5V IOut: 25 mA IQ: 1μA Operating Temperature: -40°C to 85°C Internal Configurable Pullups/Pulldown* Digikey: 568-9947-1-ND (PCAL9535A, QFN) <https://www.digikey.com/en/products/detail/nxp-usa-inc/PCAL9535AHF-128/3721166> 568-9952-1-ND (PCAL9555A, QFN) <https://www.digikey.com/en/products/detail/nxp-usa-inc/PCAL9555AHF-128/3598045> *PCAL9555A has pullups enabled by default, but remain configurable; DIGIKEY: 568-9947-1-ND; DISP: PCAL9535A; MF: NXP; MPN: PCAL9535AHF,128
U16 U17 U19 U20 U22 U23 = bschulz:MAX906*: MAX906x - Ultra-Small nanoPower Single Comparator Characteristics: Vin: 1V ~ 5.5V Response Time: 15us IQ: 100nA Internal Ref Option Open Drain Output Option Inverting Option Operating Temperature: -40°C to 85°C Digikey: MAX9064EUK+TCT-ND (SOT-23-5) <https://www.digikey.com/en/products/detail/maxim-integrated/MAX9064EUK-T/1937852>; DIGIKEY: MAX9064EUK+TCT-ND; DISP: MAX9064; MF: Maxim; MPN: MAX9064EUK+T
U18 U21 U24 = bschulz:SN74AUP1T87: SN74AUP1T87 - XNOR, 1 Element, 2 Input Characteristics: VCC: 2.3 ~ 3.6v IQ = 0.1μA Operating Temperature: -40°C to 85°C Digikey: 296-27398-1-ND (SC-70) <https://www.digikey.com/en/products/detail/texas-instruments/SN74AUP1T87DCKR/2280359?s=N4IgTCBcDaIMoDkDsAWAggVQAoEYAqAHEiALoC%2BQA>; DIGIKEY: 296-27398-1-ND; DISP: SN74AUP1T87; MF: TI; MPN: SN74AUP1T87DCKR
U28 = bschulz:PAM2401: PAM2401 - Step-Up (Boost) DC-DC Converter Characteristics: Vin: 0.9V ~ 4.75V Vout: 2.5V ~ 5V Iout: 1A IQ: 150μA Operating Temperature: -40°C to 85°C Digikey: PAM2401SCADJDICT-ND <https://www.digikey.com/en/products/detail/diodes-incorporated/PAM2401SCADJ/4898817>; DIGIKEY: PAM2401SCADJDICT-ND; MF: Diodes Inc; MPN: PAM2401SCADJ